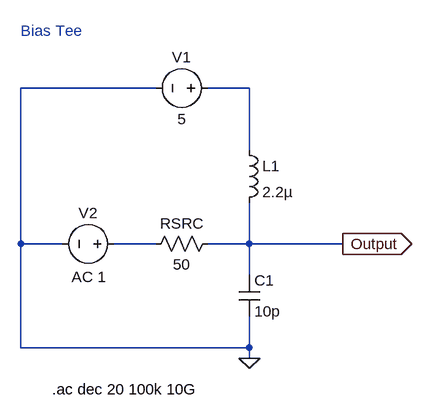
[diagram p0: schematic Bias-Tee_v1_AC.asc]
Bias-Tee_v1_AC.asc, the LTspice schematic file:
Version 4
SHEET 1 880 680
WIRE 112 0 -96 0
WIRE 256 0 192 0
WIRE 256 96 256 0
WIRE -96 240 -96 0
WIRE -32 240 -96 240
WIRE 112 240 48 240
WIRE 256 240 256 176
WIRE 256 240 192 240
WIRE 400 240 256 240
WIRE 256 288 256 240
WIRE -96 400 -96 240
WIRE 256 400 256 352
WIRE 256 400 -96 400
WIRE 256 416 256 400
FLAG 256 416 0
FLAG 400 240 Output
IOPIN 400 240 Out
SYMBOL ind 240 80 R0
SYMATTR InstName L1
SYMATTR Value 2.2µ
SYMBOL voltage 64 240 R90
WINDOW 0 -32 56 VBottom 2
WINDOW 3 32 56 VTop 2
WINDOW 123 35 55 VTop 2
WINDOW 39 0 0 Left 0
SYMATTR InstName V2
SYMATTR Value ""
SYMATTR Value2 AC 1
SYMBOL voltage 208 0 R90
WINDOW 0 -32 56 VBottom 2
WINDOW 3 32 56 VTop 2
WINDOW 123 0 0 Left 0
WINDOW 39 0 0 Left 0
SYMATTR InstName V1
SYMATTR Value 5
SYMBOL res 208 224 R90
WINDOW 0 0 56 VBottom 2
WINDOW 3 32 56 VTop 2
SYMATTR InstName RSRC
SYMATTR Value 50
SYMBOL cap 240 288 R0
SYMATTR InstName C1
SYMATTR Value 10p
TEXT -96 -88 Left 2 ;Bias Tee
TEXT -48 464 Left 2 !.ac dec 20 100k 10G

The netlist it stands for:
* Bias-Tee_v1_AC.asc
L1 N001 Output 2.2µ
V2 N002 0 AC 1
V1 N001 0 5
RSRC Output N002 50
C1 Output 0 10p
* Bias Tee
.ac dec 20 100k 10G
.backanno
.end